# EAGLE design xen_teensy_motherboard_8cv8pt_mki (EAGLE 9.6.0)
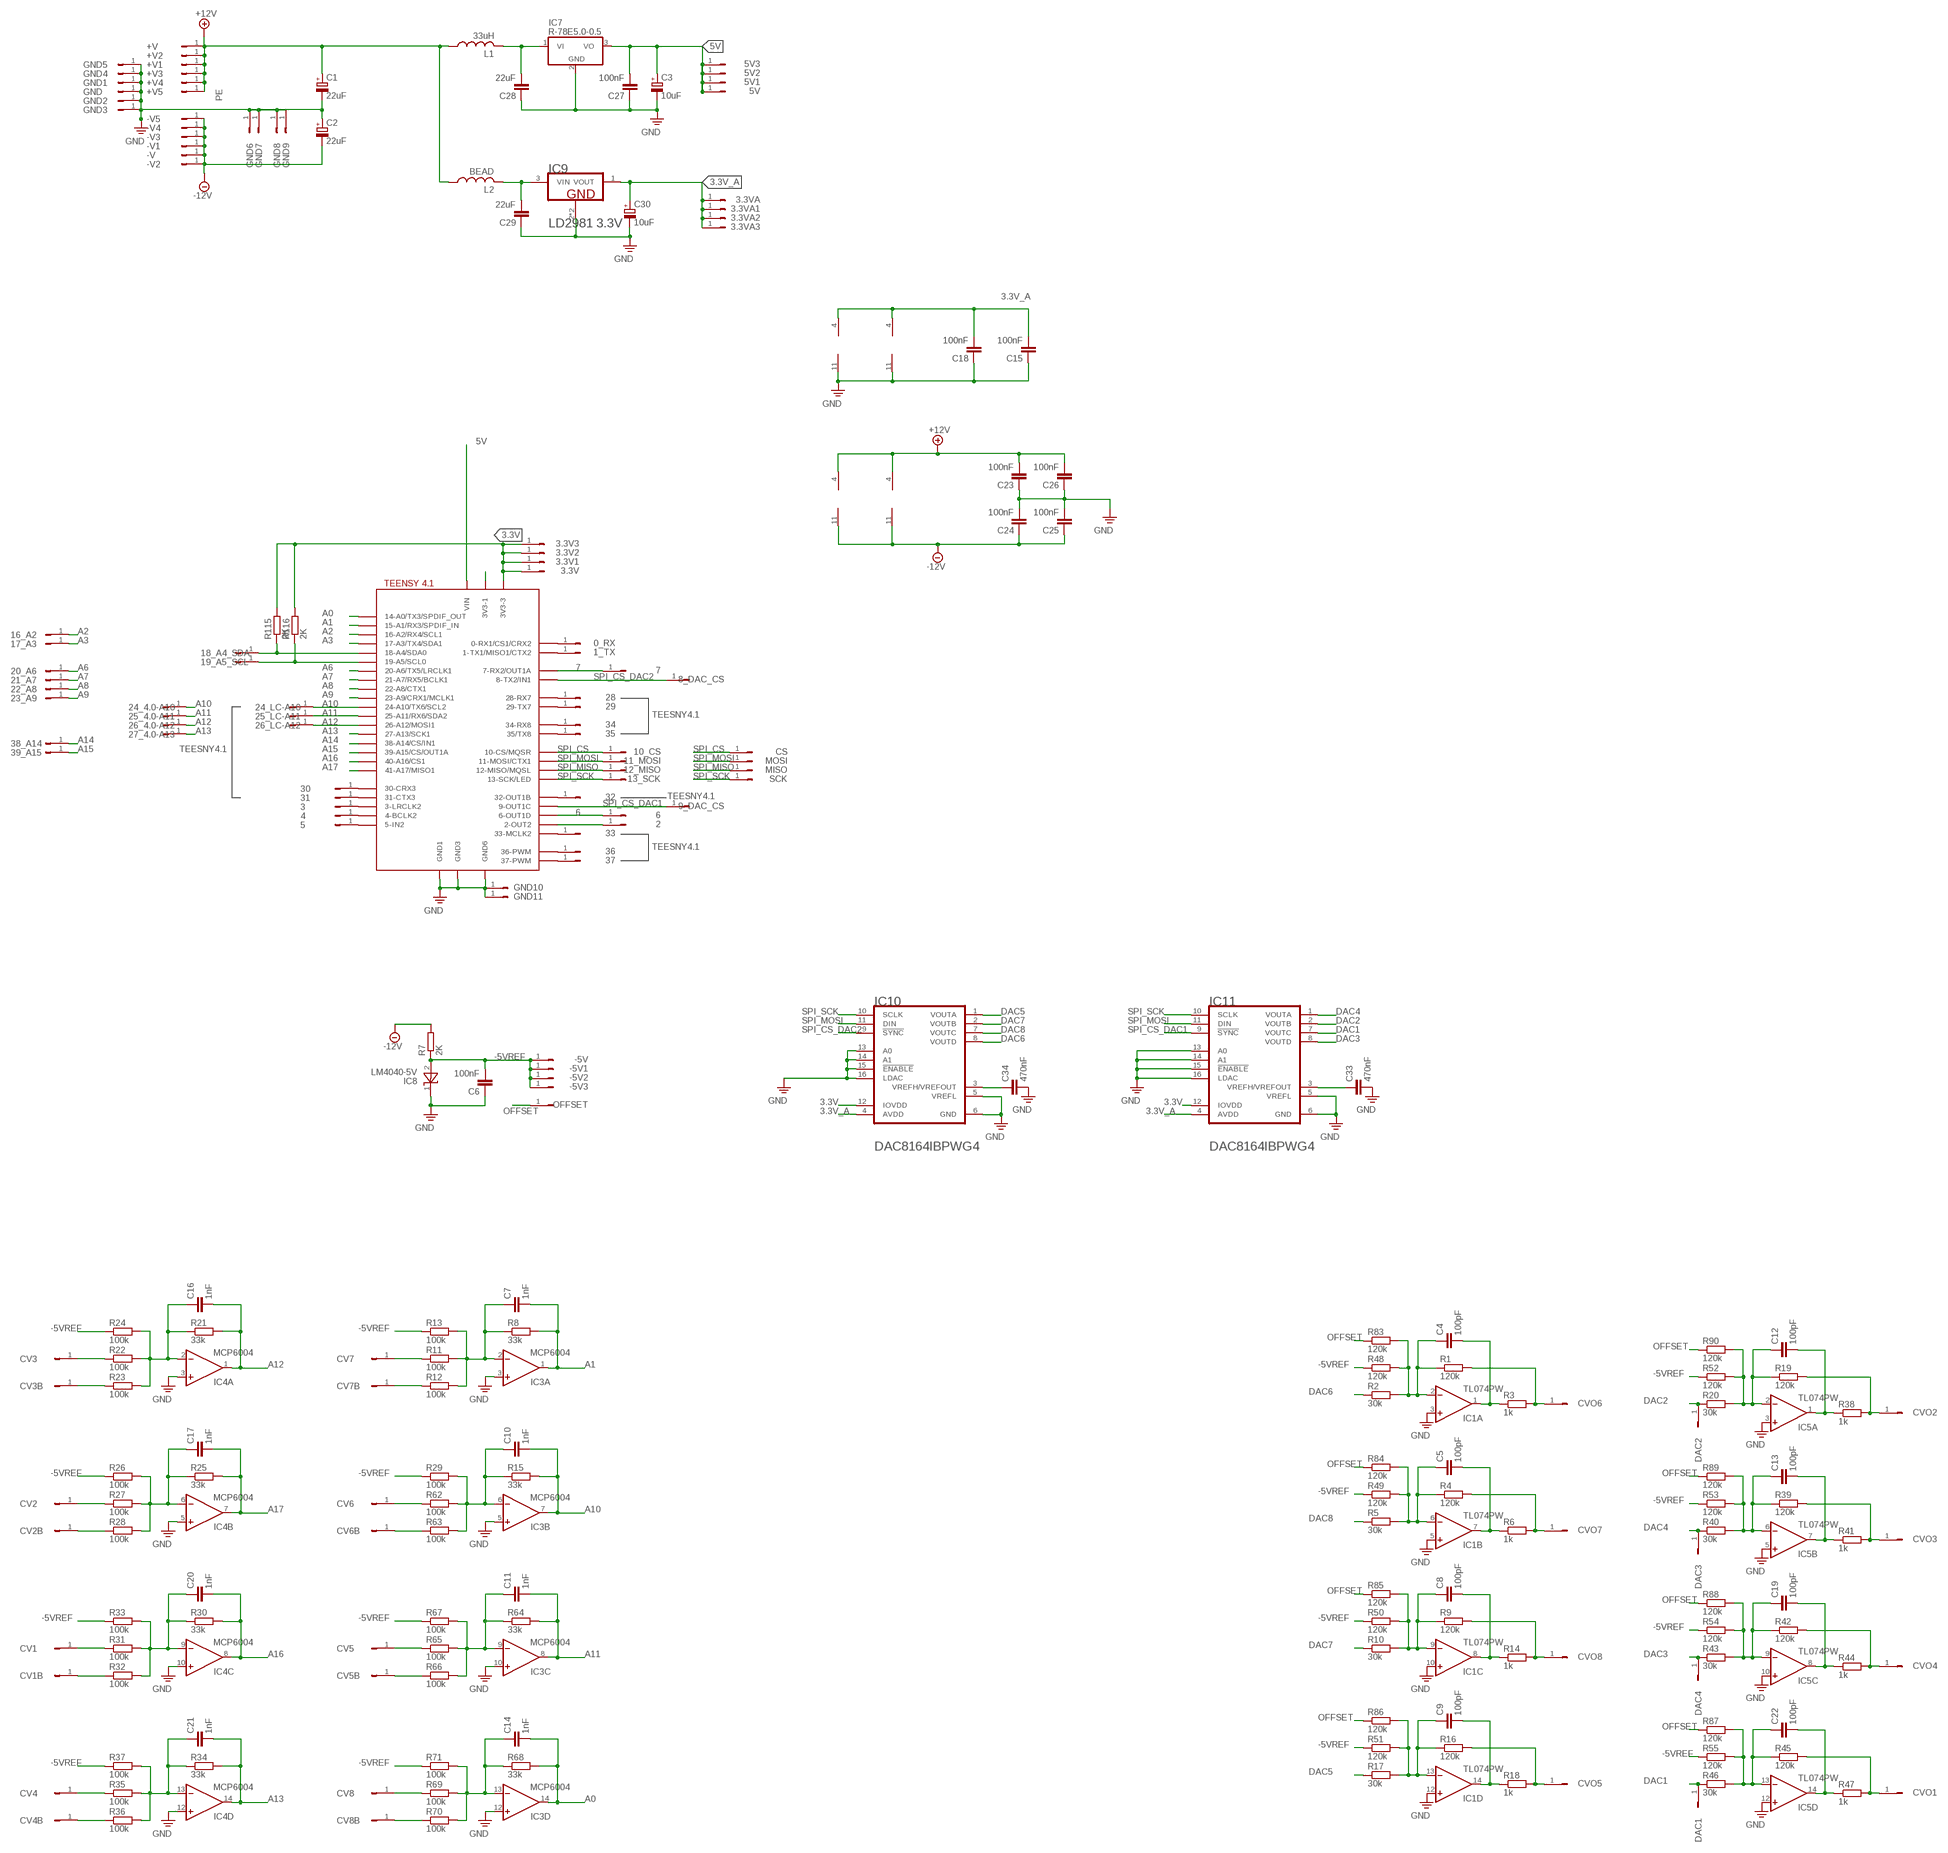
[diagram p0: schematic, sheet 1]

## Parts
0_RX  HEADER/MALE/01  [HEADER/MALE/01]
1_TX  HEADER/MALE/01  [HEADER/MALE/01]
2  HEADER/MALE/01  [HEADER/MALE/01]
3  HEADER/MALE/01  [HEADER/MALE/01]
3.3V  HEADER/MALE/01  [HEADER/MALE/01]
3.3V1  HEADER/MALE/01  [HEADER/MALE/01]
3.3V2  HEADER/MALE/01  [HEADER/MALE/01]
3.3V3  HEADER/MALE/01  [HEADER/MALE/01]
3.3VA  HEADER/MALE/01  [HEADER/MALE/01]
3.3VA1  HEADER/MALE/01  [HEADER/MALE/01]
3.3VA2  HEADER/MALE/01  [HEADER/MALE/01]
3.3VA3  HEADER/MALE/01  [HEADER/MALE/01]
4  HEADER/MALE/01  [HEADER/MALE/01]
5  HEADER/MALE/01  [HEADER/MALE/01]
5V  HEADER/MALE/01  [HEADER/MALE/01]
5V1  HEADER/MALE/01  [HEADER/MALE/01]
5V2  HEADER/MALE/01  [HEADER/MALE/01]
5V3  HEADER/MALE/01  [HEADER/MALE/01]
6  HEADER/MALE/01  [HEADER/MALE/01]
7  HEADER/MALE/01  [HEADER/MALE/01]
8_DAC_CS  HEADER/MALE/01  [HEADER/MALE/01]
9_DAC_CS  HEADER/MALE/01  [HEADER/MALE/01]
10_CS  HEADER/MALE/01  [HEADER/MALE/01]
11_MOSI  HEADER/MALE/01  [HEADER/MALE/01]
12_MISO  HEADER/MALE/01  [HEADER/MALE/01]
13_SCK  HEADER/MALE/01  [HEADER/MALE/01]
16_A2  HEADER/MALE/01  [HEADER/MALE/01]
17_A3  HEADER/MALE/01  [HEADER/MALE/01]
18_A4_SDA  HEADER/MALE/01  [HEADER/MALE/01]
19_A5_SCL  HEADER/MALE/01  [HEADER/MALE/01]
20_A6  HEADER/MALE/01  [HEADER/MALE/01]
21_A7  HEADER/MALE/01  [HEADER/MALE/01]
22_A8  HEADER/MALE/01  [HEADER/MALE/01]
23_A9  HEADER/MALE/01  [HEADER/MALE/01]
24_4.0-A10  HEADER/MALE/01  [HEADER/MALE/01]
24_LC-A10  HEADER/MALE/01  [HEADER/MALE/01]
25_4.0-A11  HEADER/MALE/01  [HEADER/MALE/01]
25_LC-A11  HEADER/MALE/01  [HEADER/MALE/01]
26_4.0-A12  HEADER/MALE/01  [HEADER/MALE/01]
26_LC-A12  HEADER/MALE/01  [HEADER/MALE/01]
27_4.0-A13  HEADER/MALE/01  [HEADER/MALE/01]
28  HEADER/MALE/01  [HEADER/MALE/01]
29  HEADER/MALE/01  [HEADER/MALE/01]
30  HEADER/MALE/01  [HEADER/MALE/01]
31  HEADER/MALE/01  [HEADER/MALE/01]
32  HEADER/MALE/01  [HEADER/MALE/01]
33  HEADER/MALE/01  [HEADER/MALE/01]
34  HEADER/MALE/01  [HEADER/MALE/01]
35  HEADER/MALE/01  [HEADER/MALE/01]
36  HEADER/MALE/01  [HEADER/MALE/01]
37  HEADER/MALE/01  [HEADER/MALE/01]
38_A14  HEADER/MALE/01  [HEADER/MALE/01]
39_A15  HEADER/MALE/01  [HEADER/MALE/01]
+V  HEADER/MALE/01  [HEADER/MALE/01]
+V1  HEADER/MALE/01  [HEADER/MALE/01]
+V2  HEADER/MALE/01  [HEADER/MALE/01]
+V3  HEADER/MALE/01  [HEADER/MALE/01]
+V4  HEADER/MALE/01  [HEADER/MALE/01]
+V5  HEADER/MALE/01  [HEADER/MALE/01]
-5V  HEADER/MALE/01  [HEADER/MALE/01]
-5V1  HEADER/MALE/01  [HEADER/MALE/01]
-5V2  HEADER/MALE/01  [HEADER/MALE/01]
-5V3  HEADER/MALE/01  [HEADER/MALE/01]
-V  HEADER/MALE/01  [HEADER/MALE/01]
-V1  HEADER/MALE/01  [HEADER/MALE/01]
-V2  HEADER/MALE/01  [HEADER/MALE/01]
-V3  HEADER/MALE/01  [HEADER/MALE/01]
-V4  HEADER/MALE/01  [HEADER/MALE/01]
-V5  HEADER/MALE/01  [HEADER/MALE/01]
C1  22uF  CAPACITOR/POLARIZEDSMDC  [SV-C]
C2  22uF  CAPACITOR/POLARIZEDSMDC  [SV-C]
C3  10uF  CAPACITOR/POLARIZEDSMDB  [SV-B]
C4  100pF  CAPACITORC0603  [C0603]
C5  100pF  CAPACITORC0603  [C0603]
C6  100nF  CAPACITORC0603  [C0603]
C7  1nF  CAPACITORC0603  [C0603]
C8  100pF  CAPACITORC0603  [C0603]
C9  100pF  CAPACITORC0603  [C0603]
C10  1nF  CAPACITORC0603  [C0603]
C11  1nF  CAPACITORC0603  [C0603]
C12  100pF  CAPACITORC0603  [C0603]
C13  100pF  CAPACITORC0603  [C0603]
C14  1nF  CAPACITORC0603  [C0603]
C15  100nF  CAPACITORC0603  [C0603]
C16  1nF  CAPACITORC0603  [C0603]
C17  1nF  CAPACITORC0603  [C0603]
C18  100nF  CAPACITORC0603  [C0603]
C19  100pF  CAPACITORC0603  [C0603]
C20  1nF  CAPACITORC0603  [C0603]
C21  1nF  CAPACITORC0603  [C0603]
C22  100pF  CAPACITORC0603  [C0603]
C23  100nF  CAPACITORC0603  [C0603]
C24  100nF  CAPACITORC0603  [C0603]
C25  100nF  CAPACITORC0603  [C0603]
C26  100nF  CAPACITORC0603  [C0603]
C27  100nF  CAPACITORC0603  [C0603]
C28  22uF  CAPACITORC0805  [C0805]
C29  22uF  CAPACITORC0805  [C0805]
C30  10uF  CAPACITOR/POLARIZEDSMDB  [SV-B]
C33  470nF  CAPACITORC0603  [C0603]
C34  470nF  CAPACITORC0603  [C0603]
CS  HEADER/MALE/01  [HEADER/MALE/01]
CV1  HEADER/MALE/01  [HEADER/MALE/01]
CV1B  HEADER/MALE/01  [HEADER/MALE/01]
CV2  HEADER/MALE/01  [HEADER/MALE/01]
CV2B  HEADER/MALE/01  [HEADER/MALE/01]
CV3  HEADER/MALE/01  [HEADER/MALE/01]
CV3B  HEADER/MALE/01  [HEADER/MALE/01]
CV4  HEADER/MALE/01  [HEADER/MALE/01]
CV4B  HEADER/MALE/01  [HEADER/MALE/01]
CV5  HEADER/MALE/01  [HEADER/MALE/01]
CV5B  HEADER/MALE/01  [HEADER/MALE/01]
CV6  HEADER/MALE/01  [HEADER/MALE/01]
CV6B  HEADER/MALE/01  [HEADER/MALE/01]
CV7  HEADER/MALE/01  [HEADER/MALE/01]
CV7B  HEADER/MALE/01  [HEADER/MALE/01]
CV8  HEADER/MALE/01  [HEADER/MALE/01]
CV8B  HEADER/MALE/01  [HEADER/MALE/01]
CVO1  HEADER/MALE/01  [HEADER/MALE/01]
CVO2  HEADER/MALE/01  [HEADER/MALE/01]
CVO3  HEADER/MALE/01  [HEADER/MALE/01]
CVO4  HEADER/MALE/01  [HEADER/MALE/01]
CVO5  HEADER/MALE/01  [HEADER/MALE/01]
CVO6  HEADER/MALE/01  [HEADER/MALE/01]
CVO7  HEADER/MALE/01  [HEADER/MALE/01]
CVO8  HEADER/MALE/01  [HEADER/MALE/01]
DAC1  HEADER/MALE/01  [HEADER/MALE/01]
DAC2  HEADER/MALE/01  [HEADER/MALE/01]
DAC3  HEADER/MALE/01  [HEADER/MALE/01]
DAC4  HEADER/MALE/01  [HEADER/MALE/01]
GND  HEADER/MALE/01  [HEADER/MALE/01]
GND1  HEADER/MALE/01  [HEADER/MALE/01]
GND2  HEADER/MALE/01  [HEADER/MALE/01]
GND3  HEADER/MALE/01  [HEADER/MALE/01]
GND4  HEADER/MALE/01  [HEADER/MALE/01]
GND5  HEADER/MALE/01  [HEADER/MALE/01]
GND6  HEADER/MALE/01  [HEADER/MALE/01]
GND7  HEADER/MALE/01  [HEADER/MALE/01]
GND8  HEADER/MALE/01  [HEADER/MALE/01]
GND9  HEADER/MALE/01  [HEADER/MALE/01]
GND10  HEADER/MALE/01  [HEADER/MALE/01]
GND11  HEADER/MALE/01  [HEADER/MALE/01]
IC1  TL074PW  [TSSOP14]
IC3  MCP6004  TL074PW  [TSSOP14]
IC4  MCP6004  TL074PW  [TSSOP14]
IC5  TL074PW  [TSSOP14]
IC6  TEENSY41-OUTER  [TENNSY41-OUTER]
IC7  R-78E5.0-0.5  WE173950378  [WE78]
IC8  LM4040-5V  LM4040CYM3-2.5  [SOT-23]
IC9  LD2981 3.3V  LD2981LD2981-SOT89  [LD2981-SOT89]
IC10  DAC8164  TEXAS_INSTRUMENTS_DAC8164IBPWG4TEXAS_INSTRUMENTS_DAC8164IBPWG4_0_1  [TEXAS_INSTRUMENTS_DAC8164IBPWG4_1]
IC11  DAC8164  TEXAS_INSTRUMENTS_DAC8164IBPWG4TEXAS_INSTRUMENTS_DAC8164IBPWG4_0_1  [TEXAS_INSTRUMENTS_DAC8164IBPWG4_1]
L1  33uH  INDUCTORL2012C  [L2012C]
L2  BEAD  INDUCTORL0603  [R0603]
MISO  HEADER/MALE/01  [HEADER/MALE/01]
MOSI  HEADER/MALE/01  [HEADER/MALE/01]
OFFSET  HEADER/MALE/01  [HEADER/MALE/01]
R1  120k  RESISTOR  [R0603]
R2  30k  RESISTOR  [R0603]
R3  1k  RESISTOR  [R0603]
R4  120k  RESISTOR  [R0603]
R5  30k  RESISTOR  [R0603]
R6  1k  RESISTOR  [R0603]
R7  2K  RESISTOR  [R0603]
R8  33k  RESISTOR  [R0603]
R9  120k  RESISTOR  [R0603]
R10  30k  RESISTOR  [R0603]
R11  100k  RESISTOR  [R0603]
R12  100k  RESISTOR  [R0603]
R13  100k  RESISTOR  [R0603]
R14  1k  RESISTOR  [R0603]
R15  33k  RESISTOR  [R0603]
R16  120k  RESISTOR  [R0603]
R17  30k  RESISTOR  [R0603]
R18  1k  RESISTOR  [R0603]
R19  120k  RESISTOR  [R0603]
R20  30k  RESISTOR  [R0603]
R21  33k  RESISTOR  [R0603]
R22  100k  RESISTOR  [R0603]
R23  100k  RESISTOR  [R0603]
R24  100k  RESISTOR  [R0603]
R25  33k  RESISTOR  [R0603]
R26  100k  RESISTOR  [R0603]
R27  100k  RESISTOR  [R0603]
R28  100k  RESISTOR  [R0603]
R29  100k  RESISTOR  [R0603]
R30  33k  RESISTOR  [R0603]
R31  100k  RESISTOR  [R0603]
R32  100k  RESISTOR  [R0603]
R33  100k  RESISTOR  [R0603]
R34  33k  RESISTOR  [R0603]
R35  100k  RESISTOR  [R0603]
R36  100k  RESISTOR  [R0603]
R37  100k  RESISTOR  [R0603]
R38  1k  RESISTOR  [R0603]
R39  120k  RESISTOR  [R0603]
R40  30k  RESISTOR  [R0603]
R41  1k  RESISTOR  [R0603]
R42  120k  RESISTOR  [R0603]
R43  30k  RESISTOR  [R0603]
R44  1k  RESISTOR  [R0603]
R45  120k  RESISTOR  [R0603]
R46  30k  RESISTOR  [R0603]
R47  1k  RESISTOR  [R0603]
R48  120k  RESISTOR  [R0603]
R49  120k  RESISTOR  [R0603]
R50  120k  RESISTOR  [R0603]
R51  120k  RESISTOR  [R0603]
R52  120k  RESISTOR  [R0603]
R53  120k  RESISTOR  [R0603]
R54  120k  RESISTOR  [R0603]
R55  120k  RESISTOR  [R0603]
R62  100k  RESISTOR  [R0603]
R63  100k  RESISTOR  [R0603]
R64  33k  RESISTOR  [R0603]
R65  100k  RESISTOR  [R0603]
R66  100k  RESISTOR  [R0603]
R67  100k  RESISTOR  [R0603]
R68  33k  RESISTOR  [R0603]
R69  100k  RESISTOR  [R0603]
R70  100k  RESISTOR  [R0603]
R71  100k  RESISTOR  [R0603]
R83  120k  RESISTOR  [R0603]
R84  120k  RESISTOR  [R0603]
R85  120k  RESISTOR  [R0603]
R86  120k  RESISTOR  [R0603]
R87  120k  RESISTOR  [R0603]
R88  120k  RESISTOR  [R0603]
R89  120k  RESISTOR  [R0603]
R90  120k  RESISTOR  [R0603]
R115  2K  RESISTOR  [R0603]
R116  2K  RESISTOR  [R0603]
SCK  HEADER/MALE/01  [HEADER/MALE/01]

## Nets
3.3V: 3.3V1.1 3.3V2.1 3.3V3.1 3.3V.1 IC6.3V3-3 IC10.12(IOVDD) IC11.12(IOVDD) R115.2 R116.2
3.3V_A: 3.3VA1.1 3.3VA2.1 3.3VA3.1 3.3VA.1 C15.2 C18.2 C30.+ IC3.4(P:V+) IC4.4(P:V+) IC9.1(VOUT) IC10.4(AVDD) IC11.4(AVDD)
5V: 5V1.1 5V2.1 5V3.1 5V.1 C3.+ C27.2 IC6.VIN IC7.3(VO)
6: 6.1 IC6.6-OUT1D
7: 7.1 IC6.7-RX2/OUT1A
+12V: +V1.1 +V2.1 +V3.1 +V4.1 +V5.1 +V.1 C1.+ C23.2 C26.2 IC1.4(P:V+) IC5.4(P:V+) L1.1 L2.1
-5VREF: -5V1.1 -5V2.1 -5V3.1 -5V.1 C6.2 IC8.2(A) R7.1 R13.1 R24.1 R26.1 R29.1 R33.1 R37.1 R48.1 R49.1 R50.1 R51.1 R52.1 R53.1 R54.1 R55.1 R67.1 R71.1
-12V: -V1.1 -V2.1 -V3.1 -V4.1 -V5.1 -V.1 C2.- C24.1 C25.1 IC1.11(P:V-) IC5.11(P:V-) R7.2
A0: C14.2 IC3.14(D:OUT) IC6.14-A0/TX3/SPDIF_OUT R68.2
A1: C7.2 IC3.1(A:OUT) IC6.15-A1/RX3/SPDIF_IN R8.2
A2: 16_A2.1 IC6.16-A2/RX4/SCL1
A3: 17_A3.1 IC6.17-A3/TX4/SDA1
A5: 19_A5_SCL.1 IC6.19-A5/SCL0 R116.1
A6: 20_A6.1 IC6.20-A6/TX5/LRCLK1
A7: 21_A7.1 IC6.21-A7/RX5/BCLK1
A8: 22_A8.1 IC6.22-A8/CTX1
A9: 23_A9.1 IC6.23-A9/CRX1/MCLK1
A10: 24_4.0-A10.1 24_LC-A10.1 C10.2 IC3.7(B:OUT) IC6.24-A10/TX6/SCL2 R15.2
A11: 25_4.0-A11.1 25_LC-A11.1 C11.2 IC3.8(C:OUT) IC6.25-A11/RX6/SDA2 R64.2
A12: 26_4.0-A12.1 26_LC-A12.1 C16.2 IC4.1(A:OUT) IC6.26-A12/MOSI1 R21.2
A13: 27_4.0-A13.1 C21.2 IC4.14(D:OUT) IC6.27-A13/SCK1 R34.2
A14: 38_A14.1 IC6.38-A14/CS/IN1
A15: 39_A15.1 IC6.39-A15/CS/OUT1A
A16: C20.2 IC4.8(C:OUT) IC6.40-A16/CS1 R30.2
A17: C17.2 IC4.7(B:OUT) IC6.41-A17/MISO1 R25.2
DAC1: DAC1.1 IC11.7(VOUTC) R46.1
DAC2: DAC2.1 IC11.2(VOUTB) R20.1
DAC3: DAC4.1 IC11.8(VOUTD) R43.1
DAC4: DAC3.1 IC11.1(VOUTA) R40.1
DAC5: IC10.1(VOUTA) R17.1
DAC6: IC10.8(VOUTD) R2.1
DAC7: IC10.2(VOUTB) R10.1
DAC8: IC10.7(VOUTC) R5.1
N$1: CV2.1 R27.1
N$2: C4.1 IC1.2(A:-IN) R1.1 R2.2 R48.2 R83.2
N$3: C4.2 IC1.1(A:OUT) R3.1
N$4: CVO6.1 R1.2 R3.2
N$5: C5.1 IC1.6(B:-IN) R4.1 R5.2 R49.2 R84.2
N$6: C5.2 IC1.7(B:OUT) R6.1
N$7: CVO7.1 R4.2 R6.2
N$8: C7.1 IC3.2(A:-IN) R8.1 R11.2 R12.2 R13.2
N$9: C8.1 IC1.9(C:-IN) R9.1 R10.2 R50.2 R85.2
N$10: C8.2 IC1.8(C:OUT) R14.1
N$11: CVO8.1 R9.2 R14.2
N$12: C9.1 IC1.13(D:-IN) R16.1 R17.2 R51.2 R86.2
N$13: CV7B.1 R12.1
N$14: CV7.1 R11.1
N$15: C9.2 IC1.14(D:OUT) R18.1
N$16: C10.1 IC3.6(B:-IN) R15.1 R29.2 R62.2 R63.2
N$17: CVO5.1 R16.2 R18.2
N$18: CV6.1 R62.1
N$19: CV6B.1 R63.1
N$20: C12.1 IC5.2(A:-IN) R19.1 R20.2 R52.2 R90.2
N$21: C12.2 IC5.1(A:OUT) R38.1
N$22: CV3.1 R22.1
N$23: 0_RX.1 IC6.0-RX1/CS1/CRX2
N$24: C16.1 IC4.2(A:-IN) R21.1 R22.2 R23.2 R24.2
N$25: CVO2.1 R19.2 R38.2
N$26: CV2B.1 R28.1
N$27: CV3B.1 R23.1
N$28: C13.1 IC5.6(B:-IN) R39.1 R40.2 R53.2 R89.2
N$29: C17.1 IC4.6(B:-IN) R25.1 R26.2 R27.2 R28.2
N$30: C21.1 IC4.13(D:-IN) R34.1 R35.2 R36.2 R37.2
N$31: CV4.1 R35.1
N$32: CV4B.1 R36.1
N$33: C13.2 IC5.7(B:OUT) R41.1
N$34: CV1B.1 R32.1
N$35: CV1.1 R31.1
N$36: C20.1 IC4.9(C:-IN) R30.1 R31.2 R32.2 R33.2
N$37: 1_TX.1 IC6.1-TX1/MISO1/CTX2
N$38: 4.1 IC6.4-BCLK2
N$39: 3.1 IC6.3-LRCLK2
N$40: 2.1 IC6.2-OUT2
N$42: CVO3.1 R39.2 R41.2
N$43: C19.1 IC5.9(C:-IN) R42.1 R43.2 R54.2 R88.2
N$44: C19.2 IC5.8(C:OUT) R44.1
N$45: 18_A4_SDA.1 IC6.18-A4/SDA0 R115.1
N$47: CVO4.1 R42.2 R44.2
N$48: C22.1 IC5.13(D:-IN) R45.1 R46.2 R55.2 R87.2
N$49: C22.2 IC5.14(D:OUT) R47.1
N$50: CVO1.1 R45.2 R47.2
N$51: C28.2 IC7.1(VI) L1.2
N$57: C14.1 IC3.13(D:-IN) R68.1 R69.2 R70.2 R71.2
N$60: CV8.1 R69.1
N$68: CV8B.1 R70.1
N$69: CV5B.1 R66.1
N$70: CV5.1 R65.1
N$71: C11.1 IC3.9(C:-IN) R64.1 R65.2 R66.2 R67.2
N$72: C29.2 IC9.3(VIN) L2.2
N$74: IC6.3V3-1
N$104: 5.1 IC6.5-IN2
N$107: C34.1 IC10.3(VREFH/VREFOUT)
N$108: 28.1 IC6.28-RX7
N$109: 29.1 IC6.29-TX7
N$110: 30.1 IC6.30-CRX3
N$111: 31.1 IC6.31-CTX3
N$112: 32.1 IC6.32-OUT1B
N$117: C33.1 IC11.3(VREFH/VREFOUT)
N$118: 34.1 IC6.34-RX8
N$119: 35.1 IC6.35-TX8(35/TX8)
N$120: 33.1 IC6.33-MCLK2
N$121: 36.1 IC6.36-PWM
N$122: 37.1 IC6.37-PWM
OFFSET: OFFSET.1 R83.1 R84.1 R85.1 R86.1 R87.1 R88.1 R89.1 R90.1
PE: C1.- C2.+ C3.- C6.1 C15.1 C18.1 C23.1 C24.2 C25.2 C26.1 C27.1 C28.1 C29.1 C30.- C33.2 C34.2 GND1.1 GND2.1 GND3.1 GND4.1 GND5.1 GND6.1 GND7.1 GND8.1 GND9.1 GND10.1 GND11.1 GND.1 IC1.3(A:+IN) IC1.5(B:+IN) IC1.10(C:+IN) IC1.12(D:+IN) IC3.3(A:+IN) IC3.5(B:+IN) IC3.10(C:+IN) IC3.11(P:V-) IC3.12(D:+IN) IC4.3(A:+IN) IC4.5(B:+IN) IC4.10(C:+IN) IC4.11(P:V-) IC4.12(D:+IN) IC5.3(A:+IN) IC5.5(B:+IN) IC5.10(C:+IN) IC5.12(D:+IN) IC6.GND1 IC6.GND3 IC6.GND6 IC7.2(GND) IC8.1(C) IC9.2(GND) IC9.2-2(GND) IC10.5(VREFL) IC10.6(GND) IC10.13(A0) IC10.14(A1) IC10.15(!ENABLE!) IC10.16(LDAC) IC11.5(VREFL) IC11.6(GND) IC11.13(A0) IC11.14(A1) IC11.15(!ENABLE!) IC11.16(LDAC) ; supply symbol labelled GND
SPI_CS: 10_CS.1 CS.1 IC6.10-CS\MQSR(10-CS/MQSR)
SPI_CS_DAC1: 9_DAC_CS.1 IC6.9-OUT1C IC11.9(!SYNC!)
SPI_CS_DAC2: 8_DAC_CS.1 IC6.8-TX2/IN1 IC10.9(!SYNC!)
SPI_MISO: 12_MISO.1 IC6.12-MISO/MQSL MISO.1
SPI_MOSI: 11_MOSI.1 IC6.11-MOSI/CTX1 IC10.11(DIN) IC11.11(DIN) MOSI.1
SPI_SCK: 13_SCK.1 IC6.13-SCK/LED IC10.10(SCLK) IC11.10(SCLK) SCK.1

## Notes on the sheet
- TEESNY4.1
- TEESNY4.1
- TEESNY4.1
- TEESNY4.1

## Library data of the parts
0_RX 1_TX 2 3 3.3V 3.3V1-3.3V3 3.3VA 3.3VA1-3.3VA3 4 5 5V 5V1-5V3 6 7 8_DAC_CS 9_DAC_CS 10_CS 11_MOSI 12_MISO 13_SCK 16_A2 17_A3 18_A4_SDA 19_A5_SCL 20_A6 21_A7 22_A8 23_A9 24_4.0-A10 24_LC-A10 25_4.0-A11 25_LC-A11 26_4.0-A12 26_LC-A12 27_4.0-A13 28-37 38_A14 39_A15 +V +V1-+V5 -5V -5V1--5V3 -V -V1--V5 CS CV1 CV1B CV2 CV2B CV3 CV3B CV4 CV4B CV5 CV5B CV6 CV6B CV7 CV7B CV8 CV8B CVO1-CVO8 DAC1-DAC4 GND GND1-GND11 MISO MOSI OFFSET SCK = connectors:HEADER/MALE/01; SPICEPREFIX: X
C1-C3 C30 = capacitors:CAPACITOR/POLARIZED: POLARIZED CAPACITOR, European symbol; SPICEPREFIX: C
C4-C29 C33 C34 = capacitors:CAPACITOR: CAPACITOR, European symbol
IC1 IC3-IC5 = ic_analogue:TL074: OP AMP
IC6 = microcontroller:TEENSY41-OUTER
IC7 = ic_voltage_reg:WE173950378
IC8 = ic_voltage_reg:LM4040
IC9 = ic_voltage_reg:LD2981: PM-REG-7805-SIL3; CIIVA_IDS: 1494330; COMPONENT_LINK_1_DESCRIPTION: Manufacturer URL; COMPONENT_LINK_1_URL: http://www.st.com; DATASHEET: http://www.st.com/internet/com/TECHNICAL_RESOURCES/TECHNICAL_LITERATURE/DATASHEET/CD00001635.pdf; DATASHEET_VERSION: 14/07/2008; FOOTPRINT_VARIANT_NAME_0: Level C; FOOTPRINT_VARIANT_NAME_1: Level B; FOOTPRINT_VARIANT_NAME_2: Level A; IMPORTED: yes; IMPORTED_FROM: vault; IMPORT_TS: 1521842653; MF: STMicroelectronics; MPN: LD2981CU33TR; PACKAGE: SOT-89; PACKAGE_DESCRIPTION: 3-Pin SOT-89 Package 1.5 mm Pitch, 4.1 mm Lead Span; PACKAGE_VERSION: 2011; PREFIX: U; RELEASE_DATE: 1329864115; VAULT_GUID: D31A5547-DC71-496C-B469-D3C4896B0EF1; VAULT_REVISION: 2FAEF0D7-B25B-4AA3-8C5F-6F8AF18FFD96
IC10 IC11 = ic_dac:TEXAS_INSTRUMENTS_DAC8164IBPWG4: TI-DACXX64PW16; CIIVA_IDS: 1106843; CODE__JEDEC: MO-153; COMPONENT_LINK_1_DESCRIPTION: Manufacturer URL; COMPONENT_LINK_1_URL: http://www.ti.com/; COMPONENT_LINK_3_DESCRIPTION: Package Specification; COMPONENT_LINK_3_URL: http://www.ti.com/lit/ml/mpds361/mpds361.pdf; DAC_CHANNELS: 4; DATASHEET: http://www.ti.com/general/docs/lit/getliterature.tsp?genericPartNumber=DAC8164&fileType=pdf; DATASHEET_VERSION: SBAS410B; DNL_MAX__LSB: 1; FOOTPRINT_VARIANT_NAME_0: Level C; FOOTPRINT_VARIANT_NAME_1: Level B; FOOTPRINT_VARIANT_NAME_2: Level A; IMPORTED: yes; IMPORTED_FROM: vault; IMPORT_TS: 1521847417; INL_MAX__LSB: 2; INTERFACE: Serial SPI; MF: Texas Instruments; MOUNTING_TECHNOLOGY: Surface Mount; MPN: DAC8164IBPWG4; PACKAGE: PW16; PACKAGE_DESCRIPTION: 16-Pin Plastic Small Outline, Body 5 x 4.4 mm, Pitch 0.65 mm; PACKAGE_VERSION: 4040064-4/G, 02/2011; PIN_0_0_9_INSIDE_EDGE: clock; POWER_CONSUMPTIONTYPMW: 2.6; PREFIX: U; RELEASE_DATE: 1386925912; RESOLUTION_BITS: 14; ROHS: Yes; SETTLING_TIMEUS: 8; SFDRD_B: 79; SNRD_B: 87; SUB_FAMILY: Precision DAC (=<10MSPS); VAULT_GUID: 4CBE38FC-6508-4746-89A4-DCA776D537C7; VAULT_REVISION: 57F45E06-978A-418D-B5AB-51E808FEEA60
L1 L2 = resistors:INDUCTOR
R1-R55 R62-R71 R83-R90 R115 R116 = resistors:RESISTOR: RESISTOR, European symbol

## Board
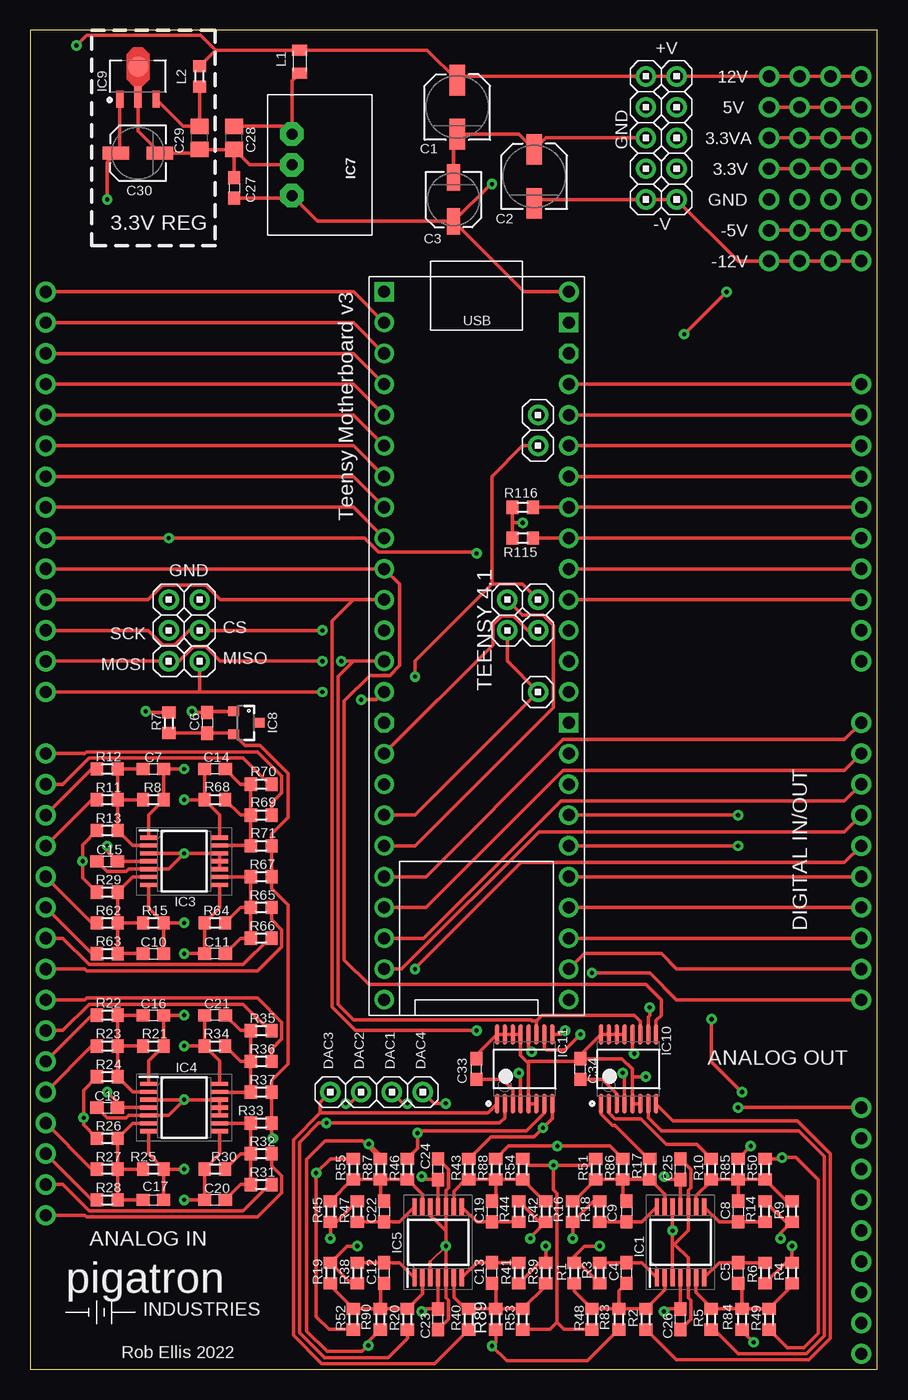
[diagram p1: board, top side]
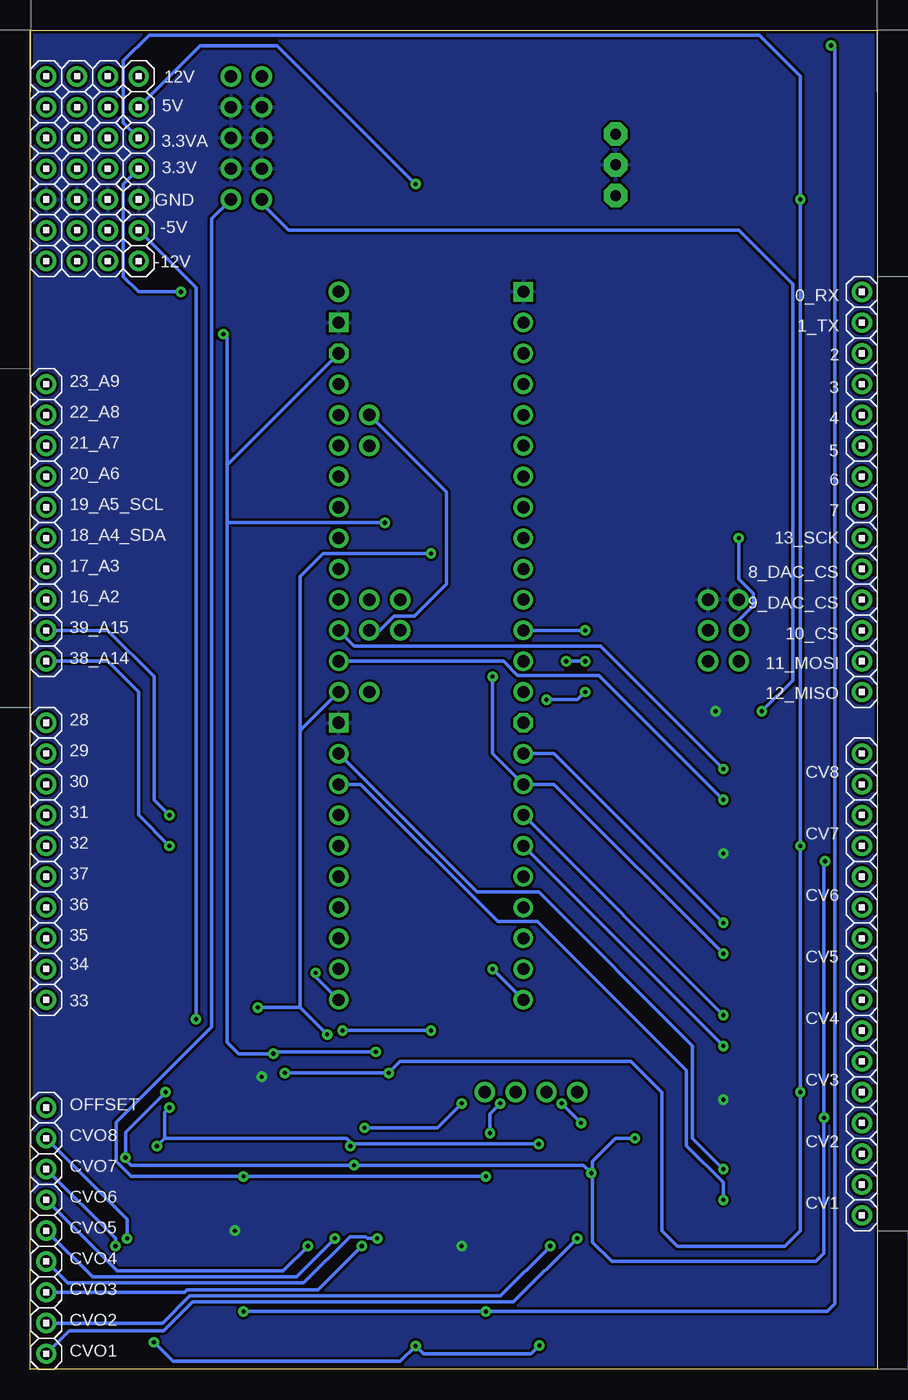
[diagram p2: board, bottom side, seen from below]

Size 69.9 x 110.48 mm. Coordinates in mm from the lower left corner, seen from the top.
Outline: 0,0 69.9,0 69.9,110.48 0,110.48 0,0
Copper layers (1*16): Top 0.0356mm / dielectric 1.5011mm / Bottom 0.0356mm
Design rules "pigatron *": minimum track width 8mil, minimum drill 13mil, track to track 8mil, track to pad 8mil, pad to pad 8mil, via to via 8mil, smd to smd 6mil, copper to edge 10mil, drill to drill 10mil, minimum pad ring 12mil, minimum via ring 10mil, stop-mask expansion 4mil, vias tented up to drill 15mil, thermal gap 10mil

### Footprints (pad centres in the part's own frame; a part is rotated, then mirrored left to right if it is on the bottom)
HEADER/MALE/01 = drill 1.016 pad 1.676: 1 0,0
SV-C = smd 2.54 x 1.27: + -2.223,0; - 2.223,0
SV-B = smd 2.184 x 1.067: + -1.81,0; - 1.81,0
C0603 = smd 1.1 x 1: 1 -0.85,0; 2 0.85,0
C0805 = smd 1.3 x 1.5: 1 -0.95,0; 2 0.95,0
TSSOP14 = smd 0.35 x 1.4: 1 -1.95,-2.938; 2 -1.3,-2.938; 3 -0.65,-2.938; 4 0,-2.938; 5 0.65,-2.938; 6 1.3,-2.938; 7 1.95,-2.938; 8 1.95,2.938; 9 1.3,2.938; 10 0.65,2.938; 11 0,2.938; 12 -0.65,2.938; 13 -1.3,2.938; 14 -1.95,2.938
TENNSY41-OUTER = drill 1: 0-RX1/CS1/CRX2 -27.94,-7.62; 1-TX1/MISO1/CTX2 -25.4,-7.62; 2-OUT2 -22.86,-7.62; 3-LRCLK2 -20.32,-7.62; 4-BCLK2 -17.78,-7.62; 5-IN2 -15.24,-7.62; 6-OUT1D -12.7,-7.62; 7-RX2/OUT1A -10.16,-7.62; 8-TX2/IN1 -7.62,-7.62; 9-OUT1C -5.08,-7.62; 10-CS\MQSR -2.54,-7.62; 11-MOSI/CTX1 0,-7.62; 12-MISO/MQSL 2.54,-7.62; 13-SCK/LED 2.54,7.62; 14-A0/TX3/SPDIF_OUT 0,7.62; 15-A1/RX3/SPDIF_IN -2.54,7.62; 16-A2/RX4/SCL1 -5.08,7.62; 17-A3/TX4/SDA1 -7.62,7.62; 18-A4/SDA0 -10.16,7.62; 19-A5/SCL0 -12.7,7.62; 20-A6/TX5/LRCLK1 -15.24,7.62; 21-A7/RX5/BCLK1 -17.78,7.62; 22-A8/CTX1 -20.32,7.62; 23-A9/CRX1/MCLK1 -22.86,7.62; 24-A10/TX6/SCL2 7.62,-7.62; 25-A11/RX6/SDA2 10.16,-7.62; 26-A12/MOSI1 12.7,-7.62; 27-A13/SCK1 15.24,-7.62; 28-RX7 17.78,-7.62; 29-TX7 20.32,-7.62; 30-CRX3 22.86,-7.62; 31-CTX3 25.4,-7.62; 32-OUT1B 27.94,-7.62; 33-MCLK2 27.94,7.62; 34-RX8 25.4,7.62; 35-TX8 22.86,7.62; 36-PWM 20.32,7.62; 37-PWM 17.78,7.62; 38-A14/CS/IN1 15.24,7.62; 39-A15/CS/OUT1A 12.7,7.62; 40-A16/CS1 10.16,7.62; 41-A17/MISO1 7.62,7.62 | drill 1 octagon: 3V3-1 5.08,-7.62; 3V3-3 -25.4,7.62 | drill 1 square: GND1 -30.48,-7.62; GND3 5.08,7.62; GND6 -27.94,7.62 | drill 1 pad 1.676: VIN -30.48,7.62
WE78 = drill 0.9 pad 1.93 octagon: 1 -2.54,0; 2 0,0; 3 2.54,0
SOT-23 = smd 0.8 x 0.9: 1 -0.95,-1; 2 0.95,-1; 3 0,1.1
LD2981-SOT89 = smd 1.4 x 0.6: 1 -1.9,1.5; 3 -1.9,-1.5 | smd 1.8 x 0.6: 2 -1.7,0 | smd 1.71 x 1.71: 2-2 0.8,0
TEXAS_INSTRUMENTS_DAC8164IBPWG4_1 = smd 1.7 x 0.35: 1 -2.85,2.275; 2 -2.85,1.625; 3 -2.85,0.975; 4 -2.85,0.325; 5 -2.85,-0.325; 6 -2.85,-0.975; 7 -2.85,-1.625; 8 -2.85,-2.275; 9 2.85,-2.275; 10 2.85,-1.625; 11 2.85,-0.975; 12 2.85,-0.325; 13 2.85,0.325; 14 2.85,0.975; 15 2.85,1.625; 16 2.85,2.275
L2012C = smd 0.9 x 1.25: 1 -0.9,0; 2 1,0
R0603 = smd 1 x 1.1: 1 -0.85,0; 2 0.85,0

### Placement (x,y rotation side)
0_RX  1.27,88.9 180 bottom
1_TX  1.27,86.36 180 bottom
2  1.27,83.82 180 bottom
3  1.27,81.28 180 bottom
3.3V  60.96,99.06 90 bottom
3.3V1  63.5,99.06 180 bottom
3.3V2  66.04,99.06 0 bottom
3.3V3  68.58,99.06 0 bottom
3.3VA  60.96,101.6 180 bottom
3.3VA1  63.5,101.6 0 bottom
3.3VA2  66.04,101.6 0 bottom
3.3VA3  68.58,101.6 0 bottom
4  1.27,78.74 180 bottom
5  1.27,76.2 180 bottom
5V  60.96,104.14 180 bottom
5V1  63.5,104.14 180 bottom
5V2  66.04,104.14 0 bottom
5V3  68.58,104.14 0 bottom
6  1.27,73.66 180 bottom
7  1.27,71.12 180 bottom
8_DAC_CS  1.27,66.04 180 bottom
9_DAC_CS  1.27,63.5 180 bottom
10_CS  1.27,60.96 180 bottom
11_MOSI  1.27,58.42 180 bottom
12_MISO  1.27,55.88 180 bottom
13_SCK  1.27,68.58 180 bottom
16_A2  68.58,63.5 0 bottom
17_A3  68.58,66.04 0 bottom
18_A4_SDA  68.58,68.58 0 bottom
19_A5_SCL  68.58,71.12 0 bottom
20_A6  68.58,73.66 0 bottom
21_A7  68.58,76.2 0 bottom
22_A8  68.58,78.74 0 bottom
23_A9  68.58,81.28 0 bottom
24_4.0-A10  41.91,60.96 90 top
24_LC-A10  41.91,78.74 180 top
25_4.0-A11  41.91,63.5 90 top
25_LC-A11  41.91,76.2 180 top
26_4.0-A12  39.37,60.96 90 top
26_LC-A12  41.91,55.88 180 top
27_4.0-A13  39.37,63.5 90 top
28  68.58,53.34 0 bottom
29  68.58,50.8 0 bottom
30  68.58,48.26 0 bottom
31  68.58,45.72 0 bottom
32  68.58,43.18 0 bottom
33  68.58,30.48 0 bottom
34  68.58,33.02 0 bottom
35  68.58,35.56 0 bottom
36  68.58,38.1 0 bottom
37  68.58,40.64 0 bottom
38_A14  68.58,58.42 0 bottom
39_A15  68.58,60.96 0 bottom
+V  53.34,106.68 0 top
+V1  63.5,106.68 0 bottom
+V2  50.8,106.68 180 top
+V3  60.96,106.68 0 bottom
+V4  66.04,106.68 0 bottom
+V5  68.58,106.68 0 bottom
-5V  63.5,93.98 180 bottom
-5V1  60.96,93.98 180 bottom
-5V2  66.04,93.98 0 bottom
-5V3  68.58,93.98 0 bottom
-V  53.34,96.52 0 top
-V1  60.96,91.44 0 bottom
-V2  50.8,96.52 180 top
-V3  63.5,91.44 0 bottom
-V4  66.04,91.44 0 bottom
-V5  68.58,91.44 0 bottom
C1  35.24,104.14 270 top
C2  41.59,98.42 270 top
C3  34.92,96.52 90 top
C4  49.21,7.94 90 top
C5  58.42,7.94 90 top
C6  14.61,53.34 270 top
C7  10.16,49.53 0 top
C8  58.42,13.02 270 top
C9  49.21,13.02 270 top
C10  10.16,34.29 0 top
C11  15.24,34.29 180 top
C12  29.21,7.94 90 top
C13  38.1,7.94 90 top
C14  15.24,49.53 180 top
C15  6.35,41.91 0 top
C16  10.16,29.21 0 top
C17  10.16,13.97 0 top
C18  6.35,21.59 0 top
C19  38.1,13.02 270 top
C20  15.24,13.97 180 top
C21  15.24,29.21 180 top
C22  29.21,13.02 270 top
C23  33.66,4.13 90 top
C24  33.66,16.51 90 top
C25  53.66,16.51 90 top
C26  53.66,4.13 90 top
C27  16.83,97.47 270 top
C28  16.83,101.6 90 top
C29  13.97,101.6 90 top
C30  8.89,100.33 0 top
C33  36.83,24.77 90 top
C34  45.4,24.77 90 top
CS  13.97,60.96 0 top
CV1  1.27,15.24 0 bottom
CV1B  1.27,12.7 0 bottom
CV2  1.27,20.32 0 bottom
CV2B  1.27,17.78 0 bottom
CV3  1.27,25.4 0 bottom
CV3B  1.27,22.86 0 bottom
CV4  1.27,27.94 0 bottom
CV4B  1.27,30.48 0 bottom
CV5  1.27,33.02 180 bottom
CV5B  1.27,35.56 180 bottom
CV6  1.27,40.64 180 bottom
CV6B  1.27,38.1 180 bottom
CV7  1.27,43.18 180 bottom
CV7B  1.27,45.72 180 bottom
CV8  1.27,50.8 180 bottom
CV8B  1.27,48.26 180 bottom
CVO1  68.58,1.27 0 bottom
CVO2  68.58,3.81 0 bottom
CVO3  68.58,6.35 0 bottom
CVO4  68.58,8.89 0 bottom
CVO5  68.58,11.43 0 bottom
CVO6  68.58,13.97 0 bottom
CVO7  68.58,16.51 0 bottom
CVO8  68.58,19.05 0 bottom
DAC1  29.84,22.86 90 top
DAC2  27.3,22.86 90 top
DAC3  24.77,22.86 90 top
DAC4  32.38,22.86 90 top
GND  53.34,101.6 0 top
GND1  53.34,104.14 0 top
GND2  50.8,99.06 180 top
GND3  53.34,99.06 180 top
GND4  50.8,101.6 0 top
GND5  50.8,104.14 0 top
GND6  63.5,96.52 0 bottom
GND7  60.96,96.52 0 bottom
GND8  66.04,96.52 0 bottom
GND9  68.58,96.52 0 bottom
GND10  11.43,63.5 180 top
GND11  13.97,63.5 0 top
IC1  53.66,10.48 0 top
IC3  12.7,41.91 270 top
IC4  12.7,21.59 270 top
IC5  33.66,10.48 0 top
IC6  36.83,58.42 270 top
IC7  21.59,99.38 270 top
IC8  17.78,53.34 270 top
IC9  8.89,106.68 90 top
IC10  49.37,24.77 90 top
IC11  40.8,24.77 90 top
L1  22.23,107.95 270 top
L2  13.97,106.68 270 top
MISO  13.97,58.42 0 top
MOSI  11.43,58.42 180 top
OFFSET  68.58,21.59 180 bottom
R1  44.89,7.94 90 top
R2  50.8,4.13 90 top
R3  46.99,7.94 270 top
R4  62.87,7.94 90 top
R5  56.2,4.13 90 top
R6  60.64,7.94 270 top
R7  11.43,53.34 90 top
R8  10.16,46.99 0 top
R9  62.87,13.02 270 top
R10  56.2,16.51 270 top
R11  6.35,46.99 0 top
R12  6.35,49.53 0 top
R13  6.35,44.45 0 top
R14  60.64,13.02 90 top
R15  10.16,36.83 0 top
R16  44.77,13.02 270 top
R17  51.12,16.51 270 top
R18  46.99,13.02 90 top
R19  24.77,7.94 90 top
R20  31.11,4.13 90 top
R21  10.16,26.67 0 top
R22  6.35,29.21 0 top
R23  6.35,26.67 0 top
R24  6.35,24.13 0 top
R25  10.16,16.51 0 top
R26  6.35,19.05 0 top
R27  6.35,16.51 0 top
R28  6.35,13.97 0 top
R29  6.35,39.37 0 top
R30  15.24,16.51 180 top
R31  19.05,15.24 180 top
R32  19.05,17.78 180 top
R33  19.05,20.32 180 top
R34  15.24,26.67 180 top
R35  19.05,27.94 180 top
R36  19.05,25.4 180 top
R37  19.05,22.86 180 top
R38  26.99,7.94 270 top
R39  42.55,7.94 90 top
R40  36.2,4.13 90 top
R41  40.32,7.94 270 top
R42  42.55,13.02 270 top
R43  36.2,16.51 270 top
R44  40.32,13.02 90 top
R45  24.77,13.02 270 top
R46  31.11,16.51 270 top
R47  26.99,13.02 90 top
R48  46.35,4.13 90 top
R49  60.96,4.13 90 top
R50  60.64,16.51 270 top
R51  46.67,16.51 270 top
R52  26.67,4.13 90 top
R53  40.64,4.13 90 top
R54  40.64,16.51 270 top
R55  26.67,16.51 270 top
R62  6.35,36.83 0 top
R63  6.35,34.29 0 top
R64  15.24,36.83 180 top
R65  19.05,38.1 180 top
R66  19.05,35.56 180 top
R67  19.05,40.64 180 top
R68  15.24,46.99 180 top
R69  19.05,45.72 180 top
R70  19.05,48.26 180 top
R71  19.05,43.18 180 top
R83  48.58,4.13 90 top
R84  58.74,4.13 90 top
R85  58.42,16.51 270 top
R86  48.9,16.51 270 top
R87  28.89,16.51 270 top
R88  38.42,16.51 270 top
R89  38.42,4.13 90 top
R90  28.89,4.13 90 top
R115  40.64,68.58 180 top
R116  40.64,71.12 180 top
SCK  11.43,60.96 180 top
U$1  [PIGATRON-LOGO]  11.81,6.29 0 top

### Tracks (layer width: path | path; a pad name or v marks a point on that pad's centre or on a via)
3.3V  (via drill 0.35)
  Top 0.305: R116.2 39.79,69.85 | 39.79,69.85 R115.2 | IC11.12 41.12,26.45 v41.39,26.18 | v49.85,26.04 49.7,26.19 IC10.12 | 3.3V.1 3.3V1.1 3.3V2.1 3.3V3.1 | 39.79,69.85 v40.64,69.85 | v53.98,85.41 v57.47,88.9
  Bottom 0.305: v41.39,26.18 49.7,26.18 v49.85,26.04 52.7,26.04 53.66,26.99 53.66,69.85 | 53.66,69.85 53.66,74.61 | 53.66,74.61 IC6.3V3-3 | v40.64,69.85 53.66,69.85 | 53.66,74.61 53.66,85.09 v53.98,85.41 | v57.47,88.9 60.96,88.9 62.23,90.17 62.23,97.79 3.3V.1
3.3V_A  (via drill 0.35)
  Top 0.305: IC9.1 7.39,100.64 C30.+ 6.35,99.6 v6.35,96.52 | IC4.4 C18.2 7.2,22.01 v6.35,22.86 | IC3.4 C15.2 6.35,42.76 v6.35,43.18 | IC11.4 40.47,24.3 v40.32,24.45 | IC10.4 49.05,24.3 v48.9,24.45 | 3.3VA.1 3.3VA1.1 3.3VA2.1 3.3VA3.1
  Bottom 0.305: v48.9,24.45 v40.32,24.45 39.37,25.4 20.32,25.4 17.78,22.86 17.78,11.43 16.51,10.16 7.62,10.16 6.35,11.43 v6.35,22.86 v6.35,43.18 v6.35,96.52 6.35,106.68 9.74,110.07 60.11,110.07 62.23,107.95 62.23,102.87 3.3VA.1
5V  (via drill 0.35)
  Top 0.305: C27.2 21.38,96.62 IC7.3 23.72,94.71 C3.+ | C3.+ 40.73,88.9 IC6.VIN | 5V3.1 5V2.1 5V1.1 5V.1 | C3.+ 38.01,97.79 v38.1,97.79
  Bottom 0.305: v38.1,97.79 49.53,109.22 55.88,109.22 5V.1
6
  Top 0.305: 6.1 26.67,73.66 IC6.6-OUT1D
7
  Top 0.305: 7.1 26.67,71.12 IC6.7-RX2/OUT1A
+12V  (via drill 0.35)
  Top 0.305: 15.29,108.85 L1.1 32.76,108.85 C1.+ 35.56,106.68 +V2.1 +V.1 +V3.1 +V1.1 +V4.1 +V5.1 | IC1.4 C26.2 52.52,4.98 v52.3,4.76 | 15.29,108.85 L2.1 | IC5.4 C23.2 32.51,4.98 v32.3,4.76 | v3.81,109.22 4.66,110.07 14.07,110.07 15.29,108.85
  Bottom 0.305: v52.3,4.76 v32.3,4.76 4.13,4.76 3.49,5.4 3.49,108.9 v3.81,109.22
-5VREF  (via drill 0.35)
  Top 0.305: v20,19.05 19.9,19.15 R33.1 R37.1 19.9,23.85 21.26,25.21 21.26,38.29 19.9,39.65 R67.1 R71.1 19.9,44.17 21.26,45.53 21.26,49.17 18.98,51.45 17.72,51.45 IC8.2 16.68,52.49 C6.2 R7.1 | R26.1 4.4,20.15 v4.4,20.75 4.4,23.03 R24.1 | R13.1 4.32,43.27 v4.32,41.91 4.32,40.55 R29.1 | -5V3.1 -5V2.1 -5V.1 -5V1.1 | v58.74,22.86 56.22,25.38 v56.22,28.89 | R55.1 24.76,17.36 v23.6,16.19 23.6,4.34 24.66,3.28 R52.1 | v43.18,16.83 41.17,16.83 R54.1 | v43.18,16.83 46.14,16.83 R51.1 | v43.18,16.83 43.18,14.79 43.45,14.52 43.45,3.86 | R50.1 61.94,17.36 v62.04,17.46 63.18,17.46 65.02,15.62 65.02,2.96 63.84,1.78 62.46,1.78 R49.1 | R53.1 42.87,3.28 43.45,3.86 | R48.1 44.03,3.28 43.45,3.86
  Bottom 0.305: v4.32,41.91 4.4,41.83 v4.4,20.75 4.4,9.57 5.08,8.89 21.91,8.89 23.5,10.48 23.5,16.19 | 23.5,16.19 23.5,17.14 21.59,19.05 v20,19.05 | v58.74,22.86 62.04,19.56 v62.04,17.46 62.04,17.27 61.59,16.83 v43.18,16.83 24.23,16.83 v23.6,16.19 23.5,16.19 | v56.22,28.89 56.22,89.24 -5V1.1
-12V  (via drill 0.35)
  Top 0.305: IC1.11 C25.1 52.55,15.66 v52.3,15.9 | R7.2 9.63,54.19 v9.53,54.29 | -V5.1 -V4.1 -V3.1 -V1.1 58.42,91.44 -V.1 -V2.1 41.91,96.52 C2.- | IC5.11 C24.1 32.54,15.66 v32.3,15.9
  Bottom 0.305: -V.1 54.93,94.93 54.93,28.26 62.82,20.36 62.82,17.14 61.59,15.9 v52.3,15.9 v32.3,15.9 | v9.53,54.29 6.99,56.83 6.99,89.53 11.43,93.98 48.58,93.98 50.8,96.2 -V2.1
A0  (via drill 0.35)
  Top 0.305: C14.2 R68.2 | R68.2 15.64,45.74 IC3.14 | R68.2 v12.7,46.99
  Bottom 0.305: IC6.14-A0/TX3/SPDIF_OUT 30.85,58.42 29.69,57.26 22.97,57.26 v12.7,46.99
A1  (via drill 0.35)
  Top 0.305: IC3.1 9.76,45.74 R8.2 C7.2 v12.7,49.53
  Bottom 0.305: v12.7,49.53 22.86,59.69 43.18,59.69 IC6.15-A1/RX3/SPDIF_IN
A2
  Top 0.305: 16_A2.1 IC6.16-A2/RX4/SCL1
A3
  Top 0.305: IC6.17-A3/TX4/SDA1 17_A3.1
A5
  Top 0.305: 19_A5_SCL.1 IC6.19-A5/SCL0 R116.1
A6
  Top 0.305: IC6.20-A6/TX5/LRCLK1 20_A6.1
A7
  Top 0.305: IC6.21-A7/RX5/BCLK1 21_A7.1
A8
  Top 0.305: 22_A8.1 IC6.22-A8/CTX1
A9
  Top 0.305: IC6.23-A9/CRX1/MCLK1 23_A9.1
A10  (via drill 0.35)
  Top 0.305: R15.2 9.76,38.08 IC3.7 | C10.2 R15.2 | R15.2 v12.7,36.83 | IC6.24-A10/TX6/SCL2 38.18,59.77 38.18,61.45 38.88,62.15 39.86,62.15 41.06,60.96 24_4.0-A10.1
  Bottom 0.305: v12.7,36.83 26.67,50.8 IC6.24-A10/TX6/SCL2 | 24_LC-A10.1 35.56,72.39 35.56,64.77 38.18,62.15 39.86,62.15 41.06,60.96 24_4.0-A10.1
A11  (via drill 0.35)
  Top 0.305: IC3.8 15.64,38.08 R64.2 C11.2 v12.7,34.29 | 38.1,64.77 40.64,64.77 25_4.0-A11.1 | 25_LC-A11.1 40.64,76.2 38.1,73.66 38.1,64.77 | v31.75,57.15 31.75,58.42 38.1,64.77
  Bottom 0.305: v12.7,34.29 26.67,48.26 IC6.25-A11/RX6/SDA2 31.75,50.8 v31.75,57.15
A12  (via drill 0.35)
  Top 0.305: IC6.26-A12/MOSI1 31.75,45.72 26_LC-A12.1 39.37,58.42 26_4.0-A12.1 | IC4.1 9.76,25.42 R21.2 C16.2 v12.7,29.21
  Bottom 0.305: IC6.26-A12/MOSI1 v12.7,29.21
A13  (via drill 0.35)
  Top 0.305: 27_4.0-A13.1 40.64,62.23 42.33,62.23 43.18,61.38 43.18,54.61 31.75,43.18 IC6.27-A13/SCK1 | R34.2 C21.2 | R34.2 15.64,25.42 IC4.14 | R34.2 v12.7,26.67
  Bottom 0.305: v12.7,26.67 IC6.27-A13/SCK1
A14  (via drill 0.35)
  Top 0.305: IC6.38-A14/CS/IN1 v58.42,43.18
  Bottom 0.305: v58.42,43.18 60.96,45.72 60.96,55.88 63.5,58.42 38_A14.1
A15  (via drill 0.35)
  Top 0.305: IC6.39-A15/CS/OUT1A v58.42,45.72
  Bottom 0.305: v58.42,45.72 59.69,46.99 59.69,57.15 63.5,60.96 39_A15.1
A16  (via drill 0.35)
  Top 0.305: IC4.8 15.64,17.76 R30.2 C20.2 v12.7,13.97
  Bottom 0.305: v12.7,13.97 12.7,15.4 15.75,18.45 15.75,24.64 28.05,36.94 31.31,36.94 42.63,48.26 IC6.40-A16/CS1
A17  (via drill 0.35)
  Top 0.305: R25.2 9.76,17.76 IC4.7 | C17.2 R25.2 | R25.2 v12.7,16.51
  Bottom 0.305: IC6.41-A17/MISO1 33.02,39.37 27.94,39.37 15.24,26.67 15.24,19.05 v12.7,16.51
DAC1  (via drill 0.35)
  Top 0.305: R46.1 31.96,18.2 v31.96,19.48 32.17,19.68 40.97,19.68 42.42,21.14 IC11.7 | DAC1.1 30.77,21.93 v31.11,21.93
  Bottom 0.305: v31.11,21.93 31.96,21.09 v31.96,19.48
DAC2  (via drill 0.35)
  Top 0.305: R20.1 31.11,2.54 29.53,0.95 24.27,0.95 22.23,3 22.23,18.73 23.81,20.32 v24.45,20.32 38.73,20.32 39.17,20.76 IC11.2 | DAC2.1 26.38,21.93 v26.04,21.93
  Bottom 0.305: v26.04,21.93 26.04,21.91 v24.45,20.32
DAC3  (via drill 0.35)
  Top 0.305: R43.1 38.01,19.18 41.57,19.18 v42.31,19.92 43.07,20.68 IC11.8 | DAC4.1 33.31,21.93 v34.29,21.93
  Bottom 0.305: v34.29,21.93 36.3,19.92 v42.31,19.92
DAC4
  Top 0.305: IC11.1 37.75,21.14 23.92,21.14 | 23.92,21.14 21.72,18.94 21.72,2.78 24.06,0.45 33.36,0.45 R40.1 | DAC3.1 23.92,22.02 23.92,21.14
DAC5
  Top 0.305: IC10.1 47.1,21.07 48.04,20.13 48.26,20.13 51.03,17.36 R17.1
DAC6
  Top 0.305: IC10.8 53.05,20.51 63.31,20.51 66.04,17.78 66.04,2.54 64.26,0.76 53.32,0.76 R2.1
DAC7
  Top 0.305: R10.1 55.02,18.54 52.49,18.54 50.4,20.64 48.25,20.64 47.75,21.14 IC10.2
DAC8
  Top 0.305: R5.1 56.41,3.28 58.42,1.27 64.05,1.27 65.53,2.75 65.53,17.57 63.42,19.68 52.07,19.68 51,20.76 IC10.7
N$1
  Top 0.305: CV2.1 5.08,16.51 R27.1
N$2
  Top 0.305: IC1.2 52.36,6.54 R2.2 R83.2 | C4.1 48.58,6.45 R83.2 | R83.2 R48.2 44.9,6.44 R1.1
N$3
  Top 0.305: IC1.1 50.46,8.79 C4.2 R3.1
N$4  (via drill 0.35)
  Top 0.305: R3.2 45.29,8.79 R1.2 44.9,9.34 45.72,10.16 v46.99,10.16
  Bottom 0.305: CVO6.1 62.74,8.13 49.02,8.13 v46.99,10.16
N$5
  Top 0.305: R84.2 R49.2 62.87,6.88 R4.1 | R84.2 R5.2 56.2,5.08 54.93,6.35 54.93,7.51 IC1.6 | C5.1 58.74,6.77 R84.2
N$6
  Top 0.305: IC1.7 56.85,8.79 C5.2 R6.1
N$7  (via drill 0.35)
  Top 0.305: R6.2 62.34,8.79 R4.2 v62.87,10.16
  Bottom 0.305: CVO7.1 62.87,10.79 v62.87,10.16
N$8
  Top 0.305: IC3.2 8.44,43.21 R13.2 R11.2 | R11.2 R12.2 C7.1 | R11.2 R8.1
N$9
  Top 0.305: R85.2 R10.2 56.2,15.56 54.93,14.29 54.93,13.45 IC1.9 | R85.2 R50.2 62.44,13.87 R9.1 | C8.1 R85.2
N$10
  Top 0.305: IC1.8 56.85,12.17 C8.2 R14.1
N$11  (via drill 0.35)
  Top 0.305: R14.2 62.34,12.17 R9.2 61.91,11.21 v61.91,10.79
  Bottom 0.305: CVO8.1 61.91,12.38 v61.91,10.79
N$12
  Top 0.305: R86.2 R17.2 52.36,14.42 IC1.13 | R86.2 R51.2 44.88,13.87 R16.1 | C9.1 48.9,14.19 R86.2
N$13
  Top 0.305: CV7B.1 5.08,49.53 R12.1
N$14
  Top 0.305: CV7.1 5.08,46.99 R11.1
N$15
  Top 0.305: R18.1 C9.2 50.46,12.17 IC1.14
N$16
  Top 0.305: R62.2 R63.2 C10.1 | R62.2 R29.2 8.44,40.61 IC3.6 | R62.2 R15.1
N$17  (via drill 0.35)
  Top 0.305: R18.2 46.47,13.87 R16.2 v44.77,10.79
  Bottom 0.305: CVO5.1 64.77,7.62 47.94,7.62 v44.77,10.79
N$18
  Top 0.305: CV6.1 5.08,36.83 R62.1
N$19
  Top 0.305: CV6B.1 5.08,34.29 R63.1
N$20
  Top 0.305: R90.2 R52.2 24.77,6.88 R19.1 | R90.2 R20.2 32.12,5.98 32.35,6.22 IC5.2 | C12.1 28.89,6.77 R90.2
N$21
  Top 0.305: IC5.1 30.46,8.79 C12.2 R38.1
N$22
  Top 0.305: CV3.1 5.08,29.21 R22.1
N$23
  Top 0.305: 0_RX.1 26.67,88.9 IC6.0-RX1/CS1/CRX2
N$24
  Top 0.305: IC4.2 8.44,22.89 R24.2 R23.2 | R23.2 R22.2 C16.1 | R23.2 R21.1
N$25  (via drill 0.35)
  Top 0.305: R38.2 26.46,7.09 R19.2 26.14,10.16 v26.99,10.16
  Bottom 0.305: CVO2.1 58.98,3.81 56.73,6.05 31.09,6.05 v26.99,10.16
N$26
  Top 0.305: CV2B.1 5.08,13.97 R28.1
N$27
  Top 0.305: CV3B.1 5.08,26.67 R23.1
N$28
  Top 0.305: R39.1 42.55,6.88 R53.2 R89.2 | R89.2 38.42,6.77 C13.1 | R89.2 R40.2 35.93,4.98 34.95,5.95 IC5.6
N$29
  Top 0.305: C17.1 R28.2 R27.2 | R27.2 R26.2 8.44,20.29 IC4.6 | R27.2 R25.1
N$30
  Top 0.305: IC4.13 15.67,22.86 R37.2 R36.2 | R36.2 R35.2 17.36,27.94 C21.1 | R36.2 17.36,25.4 R34.1
N$31
  Top 0.305: R35.1 19.75,27.94 17.58,30.12 4.85,30.12 2.68,27.94 CV4.1
N$32
  Top 0.305: CV4B.1 4.5,30.48 4.64,30.62 18.77,30.62 20.76,28.64 20.76,27.24 19.9,26.39 R36.1
N$33
  Top 0.305: IC5.7 36.85,8.79 C13.2 R41.1
N$34
  Top 0.305: CV1B.1 4.5,12.7 4.64,12.56 18.77,12.56 20.76,14.54 20.76,15.94 19.9,16.79 R32.1
N$35
  Top 0.305: R31.1 19.75,15.24 17.58,13.06 4.85,13.06 2.68,15.24 CV1.1
N$36
  Top 0.305: C20.1 17.36,15.24 R31.2 R32.2 | R30.1 17.36,17.78 R32.2 | R32.2 R33.2 18.17,20.29 IC4.9
N$37
  Top 0.305: 1_TX.1 26.67,86.36 IC6.1-TX1/MISO1/CTX2
N$38
  Top 0.305: 4.1 26.67,78.74 IC6.4-BCLK2
N$39
  Top 0.305: 3.1 26.67,81.28 IC6.3-LRCLK2
N$40
  Top 0.305: 2.1 26.67,83.82 IC6.2-OUT2
N$42  (via drill 0.35)
  Top 0.305: R41.2 42.02,8.79 R39.2 v42.55,10.16
  Bottom 0.305: CVO3.1 57.16,6.35 56.94,6.56 46.14,6.56 v42.55,10.16
N$43
  Top 0.305: R88.2 R43.2 35.93,15.66 34.95,14.69 IC5.9 | R88.2 R54.2 42.43,13.87 R42.1 | R88.2 38.42,14.19 C19.1
N$44
  Top 0.305: R44.1 C19.2 36.85,12.17 IC5.8
N$45
  Top 0.305: 18_A4_SDA.1 IC6.18-A4/SDA0 R115.1
N$47  (via drill 0.35)
  Top 0.305: R44.2 42.02,12.17 R42.2 41.27,10.9 v41.27,10.79
  Bottom 0.305: CVO4.1 66.76,7.07 66.72,7.11 47.34,7.11 43.51,10.95 42.22,10.95 42.07,10.79 v41.27,10.79
N$48
  Top 0.305: R87.2 R55.2 26.56,15.66 R45.1 | R87.2 R46.2 32.35,14.42 IC5.13 | C22.1 28.89,14.19 R87.2
N$49
  Top 0.305: IC5.14 30.46,12.17 C22.2 R47.1
N$50  (via drill 0.35)
  Top 0.305: R47.2 25.29,12.17 R45.2 v24.77,10.79
  Bottom 0.305: CVO1.1 66.67,3.17 58.9,3.17 56.52,5.55 30.01,5.55 v24.77,10.79
N$51
  Top 0.305: L1.2 21.59,106.31 IC7.1 20.95,102.55 C28.2
N$57
  Top 0.305: IC3.13 18.17,43.21 R71.2 R69.2 | R69.2 R70.2 17.36,48.26 C14.1 | R69.2 17.36,45.72 R68.1
N$60
  Top 0.305: CV8.1 4.5,50.8 4.64,50.94 18.77,50.94 20.76,48.96 20.76,47.56 19.9,46.71 R69.1
N$68
  Top 0.305: R70.1 19.75,48.26 17.58,50.44 4.85,50.44 2.68,48.26 CV8B.1
N$69
  Top 0.305: R66.1 19.75,35.56 17.58,33.38 4.85,33.38 2.68,35.56 CV5B.1
N$70
  Top 0.305: CV5.1 4.5,33.02 4.64,32.88 18.77,32.88 20.76,34.86 20.76,36.26 19.9,37.11 R65.1
N$71
  Top 0.305: R65.2 R66.2 17.36,35.56 C11.1 | R65.2 R67.2 18.17,40.61 IC3.9 | R65.2 17.36,38.1 R64.1
N$72
  Top 0.305: IC9.3 12.62,102.55 C29.2 L2.2
N$104
  Top 0.305: 5.1 26.67,76.2 IC6.5-IN2
N$107
  Top 0.305: C34.1 47.2,23.91 48.4,22.72 IC10.3
N$108
  Top 0.305: 28.1 67.2,51.96 43.97,51.96 32.65,40.64 IC6.28-RX7
N$109
  Top 0.305: 29.1 67.2,49.42 43.97,49.42 32.65,38.1 IC6.29-TX7
N$110
  Top 0.305: IC6.30-CRX3 32.46,35.56 43.78,46.88 67.2,46.88 30.1
N$111
  Top 0.305: IC6.31-CTX3 30.64,33.02 41.96,44.34 67.2,44.34 31.1
N$112  (via drill 0.35)
  Top 0.305: 32.1 67.2,41.8 40.48,41.8 31.75,33.07 v31.75,33.02
  Bottom 0.305: v31.75,33.02 IC6.32-OUT1B
N$117
  Top 0.305: C33.1 38.1,23.91 38.6,23.91 38.95,23.91 39.82,23.04 IC11.3
N$118
  Top 0.305: 34.1 53.34,33.02 52.07,34.29 45.72,34.29 IC6.34-RX8
N$119
  Top 0.305: IC6.35-TX8 35.1
N$120  (via drill 0.35)
  Top 0.305: 33.1 53.34,30.48 51.12,32.7 v46.35,32.7
  Bottom 0.305: v46.35,32.7 46.35,32.38 IC6.33-MCLK2
N$121
  Top 0.305: 36.1 IC6.36-PWM
N$122
  Top 0.305: 37.1 IC6.37-PWM
OFFSET  (via drill 0.35)
  Top 0.305: R90.1 27.89,2.27 v27.89,1.96 27.39,1.46 24.48,1.46 22.81,3.13 22.81,17.33 24.33,18.85 27.4,18.85 R87.1 28.89,17.63 v27.94,18.58 | R88.1 39.47,18.41 v43.5,18.41 47.84,18.41 R86.1 | v59.46,18.41 58.42,17.38 R85.1 | R84.1 58.74,3.17 v59.69,2.22 | R83.1 45.98,0.68 39.32,0.68 v38.1,1.91 38.42,2.22 R89.1 | OFFSET.1 v58.42,21.59
  Bottom 0.305: v27.94,18.58 43.33,18.58 | 43.33,18.58 v43.5,18.41 | v59.46,18.41 58.83,19.05 | v59.69,2.22 58.1,0.64 39.37,0.64 v38.1,1.91 37.47,1.27 28.57,1.27 v27.89,1.96 | 58.83,19.05 43.8,19.05 43.33,18.58 | v58.42,21.59 58.83,21.18 58.83,19.05
PE  (via drill 0.35)
  Top 0.203: 33.01,8.86 v34.3,10.16
  Top 0.305: GND4.1 42.55,101.6 C2.+ 40.32,101.92 C1.- 34.92,101.6 C3.- | C28.1 C27.1 | IC7.2 18.1,99.38 C28.1 | 16.5,100.33 C28.1 | C28.1 C29.1 13.65,100.33 C30.- 8.89,102.14 IC9.2 IC9.2-2 | IC1.3 53.01,10.16 | 53.01,10.16 v53.01,11.43 IC1.12 | 53.01,10.16 53.17,10.33 | 53.17,10.33 54.31,11.46 IC1.10 54.31,14.76 54.51,14.96 54.51,16.5 C25.2 | 53.17,10.33 54.31,9.19 IC1.5 54.31,5.88 54.51,5.67 54.51,4.13 C26.1 | C18.1 6.36,20.73 7.9,20.73 8.1,20.94 IC4.5 11.4,20.94 v12.7,22.24 | v12.7,22.24 IC4.12 IC4.11 IC4.10 | IC4.3 v12.7,22.24 | IC3.3 v12.7,42.56 | v12.7,42.56 IC3.12 IC3.11 IC3.10 | C15.1 6.36,41.05 7.9,41.05 8.1,41.26 IC3.5 11.4,41.26 v12.7,42.56 | C33.2 36.83,25.92 IC11.16 IC11.15 IC11.14 IC11.13 40.47,25.89 41.12,25.24 | C34.2 45.4,25.92 IC10.16 IC10.15 IC10.14 IC10.13 | IC11.6 IC11.5 41.12,25.24 | IC10.6 IC10.5 49.68,21.93 49.68,24.13 | 41.12,25.24 41.12,25.4 45.19,25.4 C34.2 | 49.68,24.13 49.68,24.77 48.84,25.61 C34.2 | 49.68,24.13 v50.8,24.13 | v13.34,54.29 13.44,54.19 C6.1 14.71,54.29 IC8.1 | C23.1 34.51,4.13 34.51,5.67 34.3,5.88 IC5.5 v34.3,10.16 34.3,11.43 | C24.2 34.51,16.5 34.51,14.96 34.3,14.76 IC5.10 34.3,11.43 | 34.3,11.43 33.38,12.36 33.33,12.36 33.01,12.69 IC5.12 | IC5.3 33.01,8.86
  pour Bottom: 0,110.49 69.85,110.49 69.85,0 0,0
SPI_CS  (via drill 0.35)
  Top 0.305: v24.11,60.96 CS.1 13.12,60.96 11.92,59.77 10.94,59.77 9.74,60.96 10_CS.1
  Bottom 0.305: v24.11,60.96 IC6.10-CS\MQSR
SPI_CS_DAC1  (via drill 0.35)
  Top 0.305: IC6.9-OUT1C 26.67,63.5 | 26.67,63.5 24.89,61.72 24.89,29.88 26.83,27.94 v36.83,27.94 | v44.13,27.94 43.81,27.61 IC11.9 | 9_DAC_CS.1 9.74,63.5 10.94,64.69 14.46,64.69 15.66,63.5 26.67,63.5
  Bottom 0.305: v36.83,27.94 v44.13,27.94
SPI_CS_DAC2
  Top 0.305: IC10.9 51.65,28.79 52.07,29.21 52.07,30.48 50.8,31.75 27.94,31.75 25.91,33.78 25.91,55.12 28.05,57.26 29.69,57.26 30.48,58.05 30.48,64.77 IC6.8-TX2/IN1 8_DAC_CS.1
SPI_MISO  (via drill 0.35)
  Top 0.305: IC6.12-MISO/MQSL 28.57,55.24 v27.3,55.24 | v24.11,55.88 13.97,55.88 | 13.97,55.88 12_MISO.1 | MISO.1 13.97,55.88
  Bottom 0.305: v27.3,55.24 24.74,55.24 v24.11,55.88
SPI_MOSI  (via drill 0.35)
  Top 0.305: IC11.11 41.77,28.76 | IC10.11 50.35,28.71 49.85,29.21 42.23,29.21 41.77,28.76 | 41.77,28.76 41.41,28.76 41.34,28.82 26.67,28.82 25.4,30.09 25.4,57.15 26.67,58.42 | 26.67,58.42 IC6.11-MOSI/CTX1 | 26.67,58.42 v25.68,58.42 | v24.11,58.42 15.66,58.42 14.46,59.61 13.48,59.61 12.28,58.42 MOSI.1 11_MOSI.1
  Bottom 0.305: v25.68,58.42 v24.11,58.42
SPI_SCK  (via drill 0.35)
  Top 0.305: IC11.10 42.42,26.47 42.55,26.35 44.13,26.35 v45.4,27.62 | v51.12,29.84 51.12,29.21 51,29.09 IC10.10 | 13_SCK.1 v11.43,68.58 27.57,68.58 28.73,67.42 36.72,67.42 v36.83,67.31
  Bottom 0.305: v45.4,27.62 47.62,29.84 | 47.62,29.84 v51.12,29.84 | 47.62,29.84 47.62,52.7 | 47.62,52.7 IC6.13-SCK/LED | v36.83,67.31 45.72,67.31 47.62,65.41 47.62,52.7 | SCK.1 11.43,61.81 10.24,63.01 10.24,63.99 11.43,65.19 v11.43,68.58

### Text on the board
tNames: 12V | 5V | 3.3VA | 3.3V | GND | 3.3V REG | -5V | -12V | Teensy Motherboard v3 | GND | DIGITAL IN/OUT | ANALOG OUT | ANALOG IN | Rob Ellis 2022
bNames: 12V | GND | -12V
tValues: DAC8164 | DAC8164